# EasyEDA Pro project OPA548.eprj

# Schematic Schematic1
Create Date: 2023-12-18; Page Name: P1; Project Name: OPA548; Schematic Name: Schematic1; Update Date: 2023-12-19; Company: 嘉立创EDA; Page Size: A4; Version: V1.0
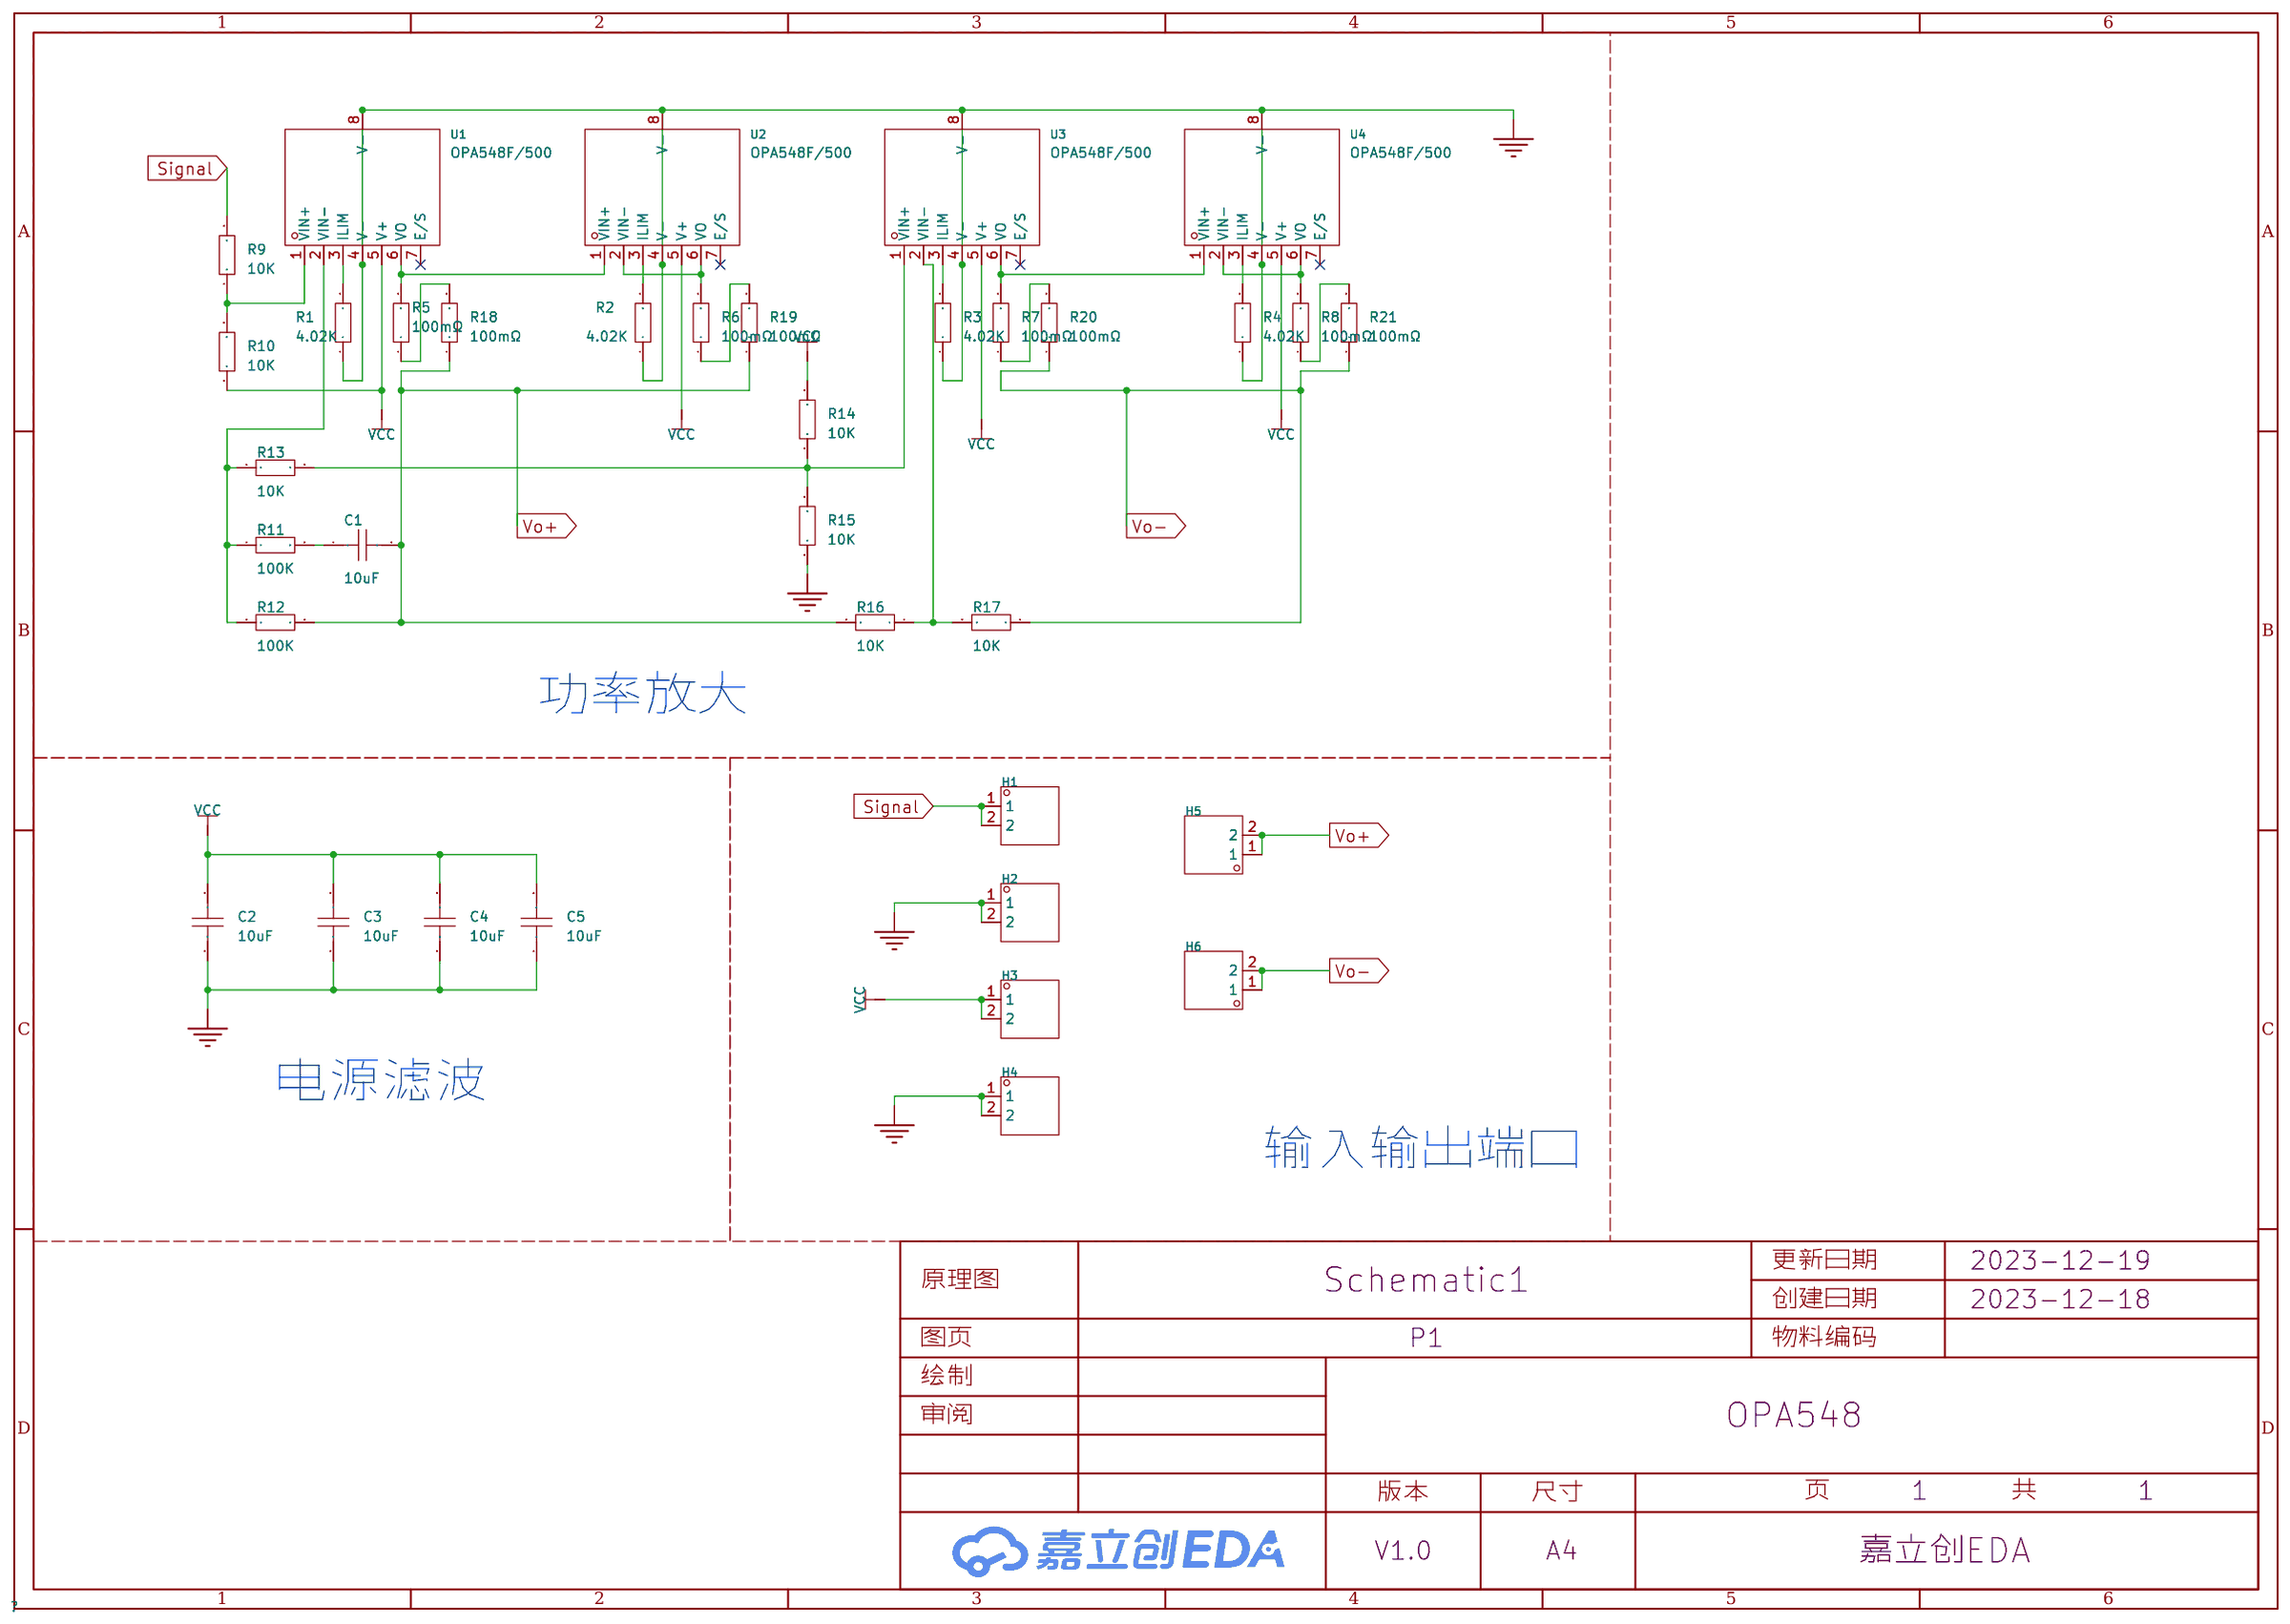
[diagram p0: schematic sheet]

## Parts
C1  10uF  [C0805]
C2  10uF  [C0805]
C3  10uF  [C0805]
C4  10uF  [C0805]
C5  10uF  [C0805]
H1  -  [HDR-TH_2P-P2.54-V-M-1]
H2  -  [HDR-TH_2P-P2.54-V-M-1]
H3  -  [HDR-TH_2P-P2.54-V-M-1]
H4  -  [HDR-TH_2P-P2.54-V-M-1]
H5  -  [HDR-TH_2P-P2.54-V-M-1]
H6  -  [HDR-TH_2P-P2.54-V-M-1]
R1  4.02K  [R0805]
R2  4.02K  [R0805]
R3  4.02K  [R0805]
R4  4.02K  [R0805]
R5  100mΩ  [R2512]
R6  100mΩ  [R2512]
R7  100mΩ  [R2512]
R8  100mΩ  [R2512]
R9  10K  [R0805]
R10  10K  [R0805]
R11  100K  [R0805]
R12  100K  [R0805]
R13  10K  [R0805]
R14  10K  [R0805]
R15  10K  [R0805]
R16  10K  [R0805]
R17  10K  [R0805]
R18  100mΩ  [R2512]
R19  100mΩ  [R2512]
R20  100mΩ  [R2512]
R21  100mΩ  [R2512]
U1  OPA548F/500  [TO-263-7_L10.2-W10.4-P1.27-LS14.4-TL]
U2  OPA548F/500  [TO-263-7_L10.2-W10.4-P1.27-LS14.4-TL]
U3  OPA548F/500  [TO-263-7_L10.2-W10.4-P1.27-LS14.4-TL]
U4  OPA548F/500  [TO-263-7_L10.2-W10.4-P1.27-LS14.4-TL]

## Library data of the parts
C1-C5 = CAP_0805: Supplier Footprint: 0805
H1-H6 = HDR-M_2.54_1x2P: Supplier Part: C124375; Supplier Footprint: 插件
R1-R4 R9-R17 = Res_0805: Supplier Footprint: 0805
R5-R8 R18-R21 = RLP25FEER100: 阻值:100mΩ;精度:±1%;功率:2W;; LCSC Part Name: 100mΩ ±1% 2W; Supplier Part: C160587; Manufacturer: 大毅科技; Supplier Footprint: 2512; JLCPCB Part Class: Extended Part; Datasheet: https://atta.szlcsc.com/upload/public/pdf/source/20180316/F8F96243FE34DFB06C9F0B3EB33744F1.pdf; Supplier: LCSC; Tolerance: ±1%; Power(Watts): 2W; Temperature Coefficient: ±50ppm/℃
U1-U4 = OPA548F/500: 放大器组数:1;带宽(-3db):-;输入偏置电流(Ib):100nA;增益带宽积(GBP):1MHz;压摆率(SR):10V/us;; Supplier Part: C527496; Manufacturer: TI(德州仪器); Supplier Footprint: TO-263-7; JLCPCB Part Class: 扩展库; Datasheet: https://www.ti.com/cn/lit/gpn/opa548; Supplier: LCSC; Number of Circuits: 1; Current - Input Bias(Ib): 100nA; Gain Bandwidth Product(GBP): 1MHz; Slew Rate(SR): 10V/us; Output Current: 5A; Operating Temperature: -40℃~+85℃

## Nets
GND: C2.1 C3.1 C4.1 C5.1 H2.1 H2.2 H4.1 H4.2 R1.1 R2.1 R3.1 R4.1 R15.1 U1.4(V-) U1.8(V-) U2.4(V-) U2.8(V-) U3.4(V-) U3.8(V-) U4.4(V-) U4.8(V-)
VCC: C2.2 C3.2 C4.2 C5.2 H3.1 H3.2 R10.1 R14.2 U1.5(V+) U2.5(V+) U3.5(V+) U4.5(V+)
Signal: H1.1 H1.2 R9.2
Vo+: C1.2 H5.1 H5.2 R12.2 R16.2 R18.1 R19.1
Vo-: H6.1 H6.2 R17.1 R20.1 R21.1
$1N1094: R1.2 U1.3(ILIM)
$1N1186: R2.2 U2.3(ILIM)
$1N1226: R3.2 U3.3(ILIM)
$1N1269: R4.2 U4.3(ILIM)
$1N1326: R9.1 R10.2 U1.1(VIN+)
$1N1740: C1.1 R11.2
$1N1796: R6.2 U2.2(VIN-) U2.6(VO)
$1N1922: R11.1 R12.1 R13.1 U1.2(VIN-)
$1N2107: R13.2 R14.1 R15.2 U3.1(VIN+)
$1N2181: R7.2 U3.6(VO) U4.1(VIN+)
$1N2190: R8.2 U4.2(VIN-) U4.6(VO)
$1N2215: R16.1 R17.2 U3.2(VIN-)
$1N3681: R5.2 U1.6(VO) U2.1(VIN+)
$1N3687: R5.1 R18.2
$1N3734: R6.1 R19.2
$1N3790: R7.1 R20.2
$1N3837: R8.1 R21.2

Not connected (* = marked no-connect by the designer): U1 7(E/S)*; U2 7(E/S)*; U3 7(E/S)*; U4 7(E/S)*

## Notes on the sheet
- 功率放大
- 电源滤波
- 输入输出端口

# Board PCB1
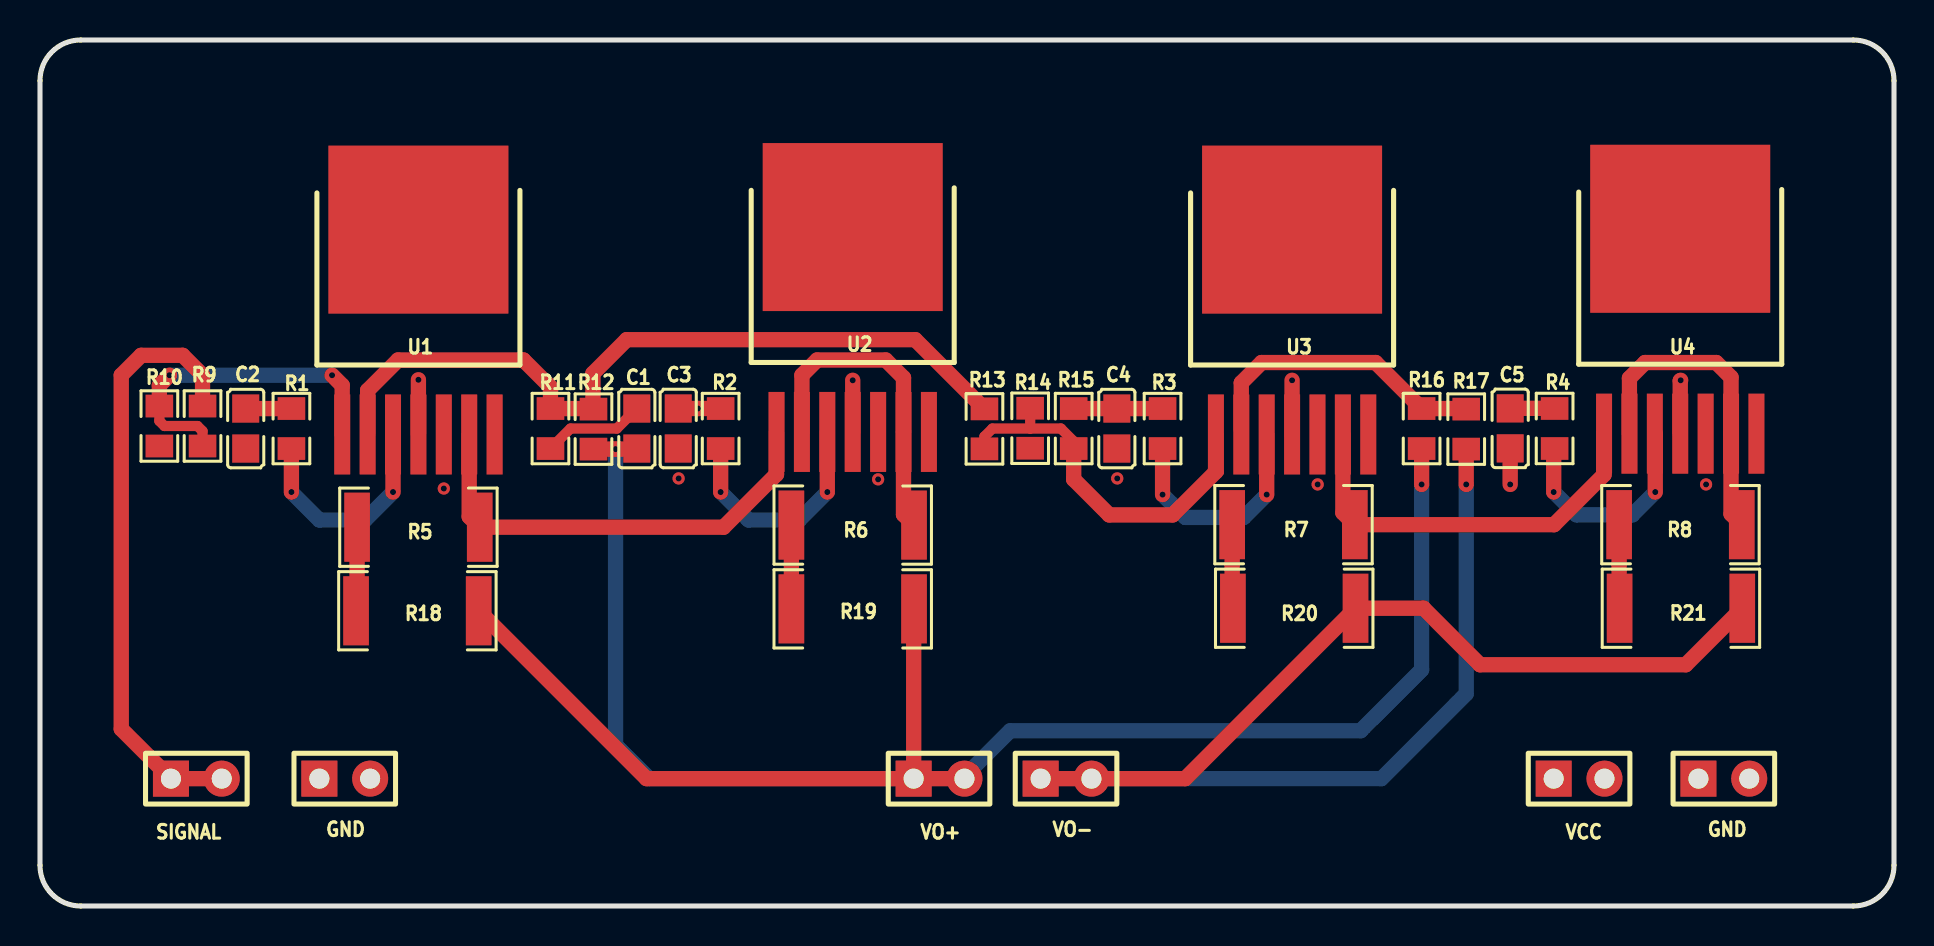
[diagram p1: board, top side]
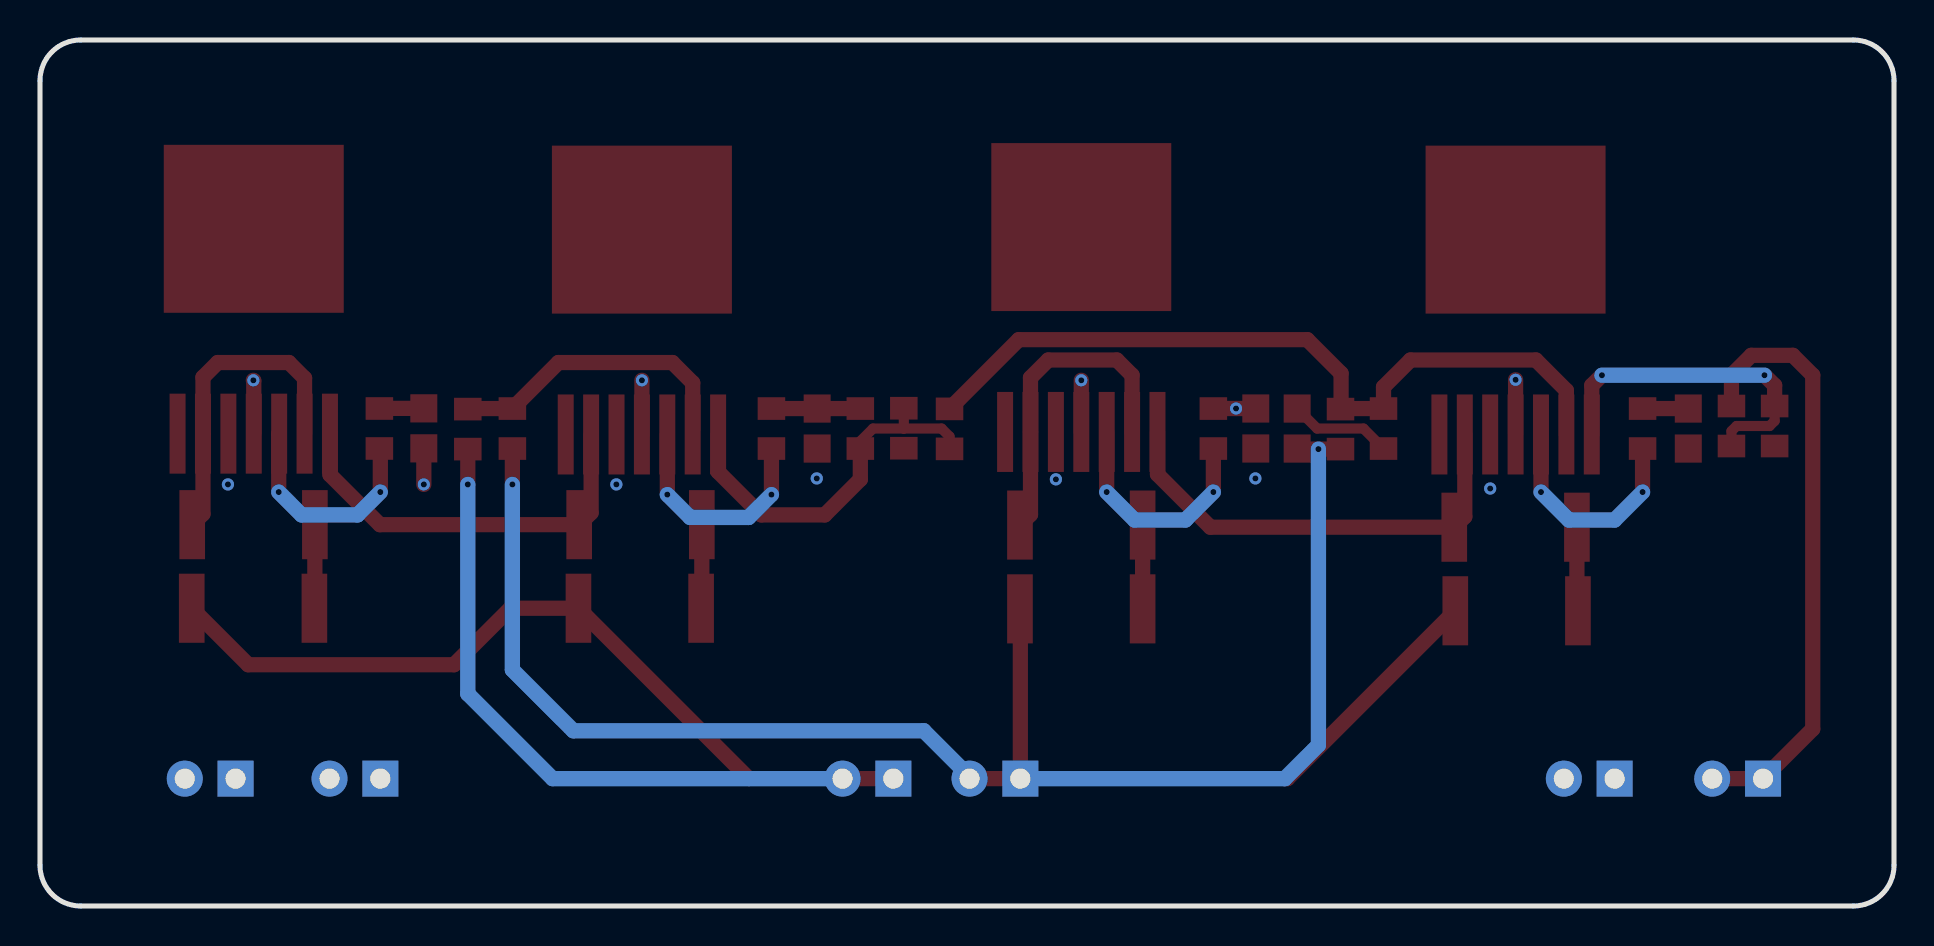
[diagram p2: board, bottom side, seen from below]

Outline 92.71 x 43.31 mm; copper layers: Top Layer, Bottom Layer. Coordinates in mm from the lower left corner of the outline.
Outline path: 0,41.28 0,2.03 arc(0.6,0.6) 2.03,0 90.68,0 arc(92.11,0.6) 92.71,2.03 92.71,41.28 arc(92.11,42.71) 90.68,43.31 2.03,43.31 arc(0.6,42.71) 0,41.28
Stack: Top Layer 0.035mm / Dielectric1 1.51mm FR4 er 4.5 / Bottom Layer 0.035mm

## Design rules (mm)
template: 自定义配置
spacing copperThickness1oz (default): track to track 0.102, other pairs 0.152 to 0.3
spacing copperThickness2oz: track to track 0.203, other pairs 0.152 to 0.3
track width copperThickness1oz (default): min 0.127, default 0.254, max 2.54
track width copperThickness2oz: min 0.203, default 0.254, max 2.54
differential pair differentialPair (default): width min 0.127, default 0.254, max 2.54; gap min 0.152, default 0.152
via viaSize (default): diameter min 0.5, default 0.61, max 10; hole min 0.3, default 0.305, max 6.3
net GND uses copperRegion1
net VCC uses copperRegion1

## Placement (name value [footprint] x y rotation side)
C1  10uF  [C0805]  29.84 23.88 270 top
C2  10uF  [C0805]  10.29 23.88 270 top
C3  10uF  [C0805]  31.91 23.88 270 top
C4  10uF  [C0805]  53.85 23.88 270 top
C5  10uF  [C0805]  73.52 23.89 270 top
GND  -  [HDR-TH_2P-P2.54-V-M-1]  15.24 6.37 0 top
GND#2  -  [HDR-TH_2P-P2.54-V-M-1]  84.2 6.37 0 top
R1  4.02K  [R0805]  12.57 23.88 270 top
R2  4.02K  [R0805]  34.04 23.88 270 top
R3  4.02K  [R0805]  56.13 23.88 270 top
R4  4.02K  [R0805]  75.74 23.88 270 top
R5  100mΩ  [R2512]  18.92 18.94 0 top
R6  100mΩ  [R2512]  40.64 19.05 0 top
R7  100mΩ  [R2512]  62.68 19.07 0 top
R8  100mΩ  [R2512]  82.03 19.07 0 top
R9  10K  [R0805]  8.13 24 90 top
R10  10K  [R0805]  5.97 24 90 top
R11  100K  [R0805]  25.53 23.88 270 top
R12  100K  [R0805]  27.68 23.85 270 top
R13  10K  [R0805]  47.23 23.86 270 top
R14  10K  [R0805]  49.51 23.89 270 top
R15  10K  [R0805]  51.69 23.88 270 top
R16  10K  [R0805]  69.09 23.88 270 top
R17  10K  [R0805]  71.32 23.85 90 top
R18  100mΩ  [R2512]  18.87 14.76 180 top
R19  100mΩ  [R2512]  40.64 14.86 180 top
R20  100mΩ  [R2512]  62.72 14.89 180 top
R21  100mΩ  [R2512]  82.06 14.89 180 top
SIGNAL  -  [HDR-TH_2P-P2.54-V-M-1]  7.82 6.37 0 top
U1  OPA548F/500  [TO-263-7_L10.2-W10.4-P1.27-LS14.4-TL]  18.92 28.7 90 top
U2  OPA548F/500  [TO-263-7_L10.2-W10.4-P1.27-LS14.4-TL]  40.64 28.83 90 top
U3  OPA548F/500  [TO-263-7_L10.2-W10.4-P1.27-LS14.4-TL]  62.61 28.7 90 top
U4  OPA548F/500  [TO-263-7_L10.2-W10.4-P1.27-LS14.4-TL]  82.02 28.74 90 top
VCC  -  [HDR-TH_2P-P2.54-V-M-1]  76.96 6.37 0 top
VO+  -  [HDR-TH_2P-P2.54-V-M-1]  44.96 6.37 0 top
VO-  -  [HDR-TH_2P-P2.54-V-M-1]  51.31 6.37 0 top

## Footprints (pads in the part's own frame, mm; a bottom-side part is the same pattern mirrored in y, then rotated)
C0805
  rect 1.41x1.35 smd: 1(-1,0) 2(1,0)
HDR-TH_2P-P2.54-V-M-1
  rect 1.8x1.8 hole 1: 1(-1.27,0)
  round 1.8 hole 1: 2(1.27,0)
R0805
  rect 1.133x1.377 smd: 1(-1,0) 2(1,0)
R2512
  rect 1.282x3.456 smd: 1(-3.067,0) 2(3.067,0)
TO-263-7_L10.2-W10.4-P1.27-LS14.4-TL
  rect 4x0.8 smd: 1(-5.122,3.81) 2(-5.122,2.54) 3(-5.122,1.27) 4(-5.122,0) 5(-5.122,-1.27) 6(-5.122,-2.54) 7(-5.122,-3.81)
  rect 8.4x9 smd: 8(5.122,0)

## Nets
GND: C2.1 C3.1 C4.1 C5.1 GND.1 GND.2 GND#2.1 GND#2.2 R1.1 R2.1 R3.1 R4.1 R15.1 U1.4 U1.8 U2.4 U2.8 U3.4 U3.8 U4.4 U4.8
VCC: C2.2 C3.2 C4.2 C5.2 R10.1 R14.2 U1.5 U2.5 U3.5 U4.5 VCC.1 VCC.2
SIGNAL: R9.2 SIGNAL.1 SIGNAL.2
VO+: C1.2 R12.2 R16.2 R18.1 R19.1 VO+.1 VO+.2
VO-: R17.1 R20.1 R21.1 VO-.1 VO-.2
$1N1094: R1.2 U1.3
$1N1186: R2.2 U2.3
$1N1226: R3.2 U3.3
$1N1269: R4.2 U4.3
$1N1326: R9.1 R10.2 U1.1
$1N1740: C1.1 R11.2
$1N1796: R6.2 U2.2 U2.6
$1N1922: R11.1 R12.1 R13.1 U1.2
$1N2107: R13.2 R14.1 R15.2 U3.1
$1N2181: R7.2 U3.6 U4.1
$1N2190: R8.2 U4.2 U4.6
$1N2215: R16.1 R17.2 U3.2
$1N3681: R5.2 U1.6 U2.1
$1N3687: R5.1 R18.2
$1N3734: R6.1 R19.2
$1N3790: R7.1 R20.2
$1N3837: R8.1 R21.2

Pads without a net: U1 7; U2 7; U3 7; U4 7

## Via types
v1: diameter 0.61, hole 0.305, Top Layer to Bottom Layer, 25 vias

## Routing (per net, layer and track width the routed paths; a pad name or vN(x,y) marks a point on that pad's centre or on a via; arc(x,y) is an arc through that point)
GND: length 21.8
  Top Layer w0.762: C2.1 R1.1 ; R4.1 75.73,24.89 C5.1 ; R2.1 34.03,24.88 v1(32.9,24.88) C3.1 ; R15.1 C4.1 R3.1 ; v1(82.04,26.29) 82.02,26.27 U4.4 ; U2.4 v1(40.64,26.29) ; U1.4 v1(18.92,26.31) ; U3.4 v1(62.61,26.29)
VCC: length 1.8
  Top Layer w0.762: C5.2 v1(73.52,21.08)
  vias: v1(20.19,20.88) v1(31.93,21.38) v1(41.91,21.34) v1(53.87,21.38) v1(63.89,21.08) v1(83.31,21.08)
SIGNAL: length 30.2
  Top Layer w0.762: SIGNAL.2 SIGNAL.1 4.06,8.85 4.06,26.54 5.06,27.54 7.13,27.54 8.13,26.54 R9.2
VO+: length 104.8
  Top Layer w0.762: 69.09,22.62 v1(69.09,21.08) ; VO+.1 30.33,6.37 R18.1 ; VO+.1 43.69,14.84 R19.1 ; VO+.1 VO+.2 ; C1.2 29.82,22.85 v1(28.78,22.85) R12.2
  Bottom Layer w0.762: v1(69.09,21.08) 69.09,11.81 66.04,8.76 48.51,8.76 46.23,6.48 VO+.2 ; VO+.1 30.46,6.37 28.78,8.05 v1(28.78,22.85)
VO-: length 73.4
  Top Layer w0.762: 71.32,22.59 v1(71.32,21.08) ; R21.1 82.3,12.06 72.01,12.06 69.18,14.89 R20.1 57.26,6.37 VO-.2 VO-.1
  Bottom Layer w0.762: v1(71.32,21.08) 71.32,10.61 67.07,6.37 VO-.2
$1N1094: length 11.3
  Top Layer w0.762: v1(12.57,20.7) R1.2 ; U1.3 v1(17.65,20.7)
  Bottom Layer w0.762: v1(12.57,20.7) 13.97,19.3 16.26,19.3 v1(17.65,20.7)
$1N1186: length 11.7
  Top Layer w0.762: U2.3 v1(39.37,20.7) ; R2.2 v1(34.04,20.7)
  Bottom Layer w0.762: v1(34.04,20.7) 35.43,19.3 37.97,19.3 v1(39.37,20.7)
$1N1226: length 11.5
  Top Layer w0.762: v1(61.34,20.57) U3.3 ; v1(56.13,20.57) R3.2
  Bottom Layer w0.762: v1(61.34,20.57) 60.2,19.43 57.28,19.43 v1(56.13,20.57)
$1N1269: length 10.9
  Top Layer w0.762: v1(80.77,20.7) 80.77,23.6 U4.3 ; v1(75.69,20.7) 75.69,22.58 75.74,22.63
  Bottom Layer w0.762: v1(80.77,20.7) 79.63,19.56 76.84,19.56 v1(75.69,20.7)
$1N1326: length 16.9
  Top Layer w0.508: R10.2 5.97,24.26 6.22,24 7.87,24 8.13,23.75 R9.1
  Top Layer w0.762: v1(6.48,26.54) 5.97,26.04 R10.2 ; U1.1 15.11,26.04 v1(14.61,26.54)
  Bottom Layer w0.762: v1(6.48,26.54) v1(14.61,26.54)
$1N1740: length 5.1
  Top Layer w0.508: C1.1 28.84,23.88 26.53,23.88 R11.2
$1N1796: length 16.2
  Top Layer w0.762: U2.2 38.1,26.54 38.86,27.31 42.29,27.31 43.18,26.42 U2.6 43.18,19.58 R6.2
$1N1922: length 39.2
  Top Layer w0.762: U1.2 16.38,25.78 17.91,27.31 24.18,27.31 25.53,25.95 R11.1 27.65,24.88 ; 27.65,24.88 27.65,26.63 29.34,28.32 43.77,28.32 R13.1 ; 27.65,24.88 R12.1
$1N2107: length 19
  Top Layer w0.508: 49.52,23.88 47.62,23.88 47.23,23.48 R13.2 ; 49.52,23.88 49.51,23.88 R14.1 ; 49.52,23.88 51.05,23.88 51.69,23.24 R15.2
  Top Layer w0.762: R15.2 51.69,21.34 53.47,19.56 56.64,19.56 58.8,21.72 U3.1
$1N2181: length 20.3
  Top Layer w0.762: U3.6 65.15,19.67 R7.2 75.71,19.07 78.21,21.57 U4.1
$1N2190: length 16.1
  Top Layer w0.762: U4.2 79.48,26.39 80.26,27.18 83.82,27.18 84.56,26.44 U4.6 84.56,19.61 R8.2
$1N2215: length 15
  Top Layer w0.762: R17.2 71.29,24.88 R16.1 66.79,27.18 61.09,27.18 60.07,26.16 60.07,23.83
$1N3681: length 22.9
  Top Layer w0.762: U2.1 36.83,21.59 34.18,18.94 R5.2 21.46,19.47 U1.6
$1N3687: length 4.2
  Top Layer w0.762: R5.1 15.86,14.82 R18.2
$1N3734: length 4.2
  Top Layer w0.762: R6.1 R19.2
$1N3790: length 4.3
  Top Layer w0.762: 59.62,18.43 59.62,14.16 59.65,14.13
$1N3837: length 4.2
  Top Layer w0.762: R21.2 78.97,14.91 R8.1

## Copper pours and planes (outline as drawn; the poured copper is in the pictures)
GND on Top Layer: -4.83,45.47 96.77,45.47 96.77,-3.68 -4.83,-3.68
GND on Bottom Layer: -2.16,46.86 95.5,46.86 95.5,-2.92 -2.16,-2.92
VCC on Top Layer: 4.77,9.2 7.11,6.86 73.27,6.86 73.79,6.24 73.79,5.22 74.54,4.57 79.63,4.57 80.39,5.33 80.39,7.49 81.03,8.13 86.49,8.13 87,8.64 87,22.86 86.36,23.5 5.15,23.5 4.77,23.11
VCC on Bottom Layer: 4.73,9.26 6.95,7.05 73.11,7.05 73.88,6.13 73.88,5.17 74.5,4.64 79.59,4.64 80.36,5.4 80.36,7.56 80.99,8.19 86.45,8.19 86.96,8.7 86.96,22.92 85.82,24.07 5.62,24.07 4.73,23.18

Small or netless copper shapes (teardrops, artwork), in the pictures only: 1 on Top Layer
